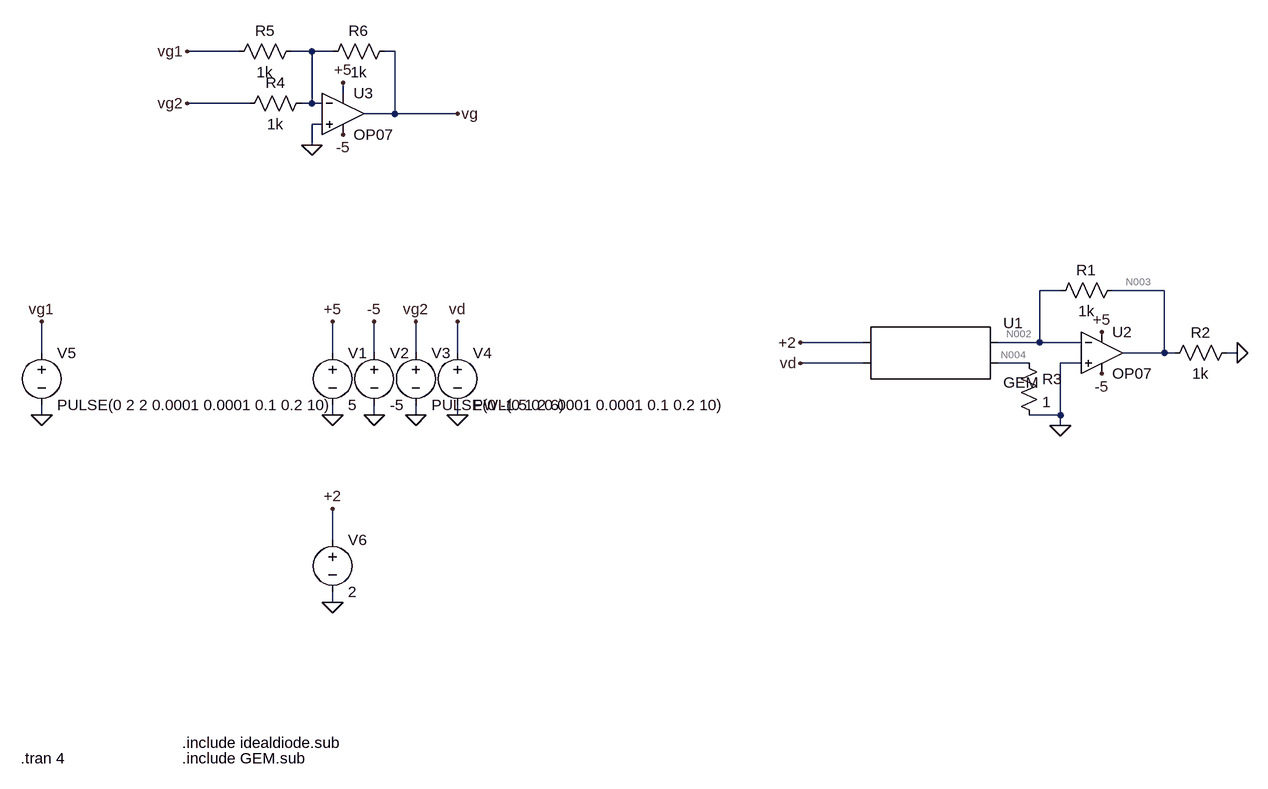
[diagram p0: schematic TestCircui4GEM.asc]
* TestCircui4GEM.asc
* U1: GEM (symbol AutoGenerated\VTEAMtri not available, pins judged from their places): pin1=+2 pin2=vd pin3=N002 pin4=N004
R1 N003 N002 1k
XU2 0 N002 +5 -5 N003 LT1001  ; OP07, pins In+ In- V+ V- OUT
V1 +5 0 5
V2 -5 0 -5
V3 vg2 0 PULSE(0 -1.5 0 0.0001 0.0001 0.1 0.2 10)
V4 vd 0 PWL(0 1 2 6)
R2 0 N003 1k
R3 N004 0 1
V5 vg1 0 PULSE(0 2 2 0.0001 0.0001 0.1 0.2 10)
XU3 0 N001 +5 -5 vg LT1001  ; OP07, pins In+ In- V+ V- OUT
R4 N001 vg2 1k
R5 N001 vg1 1k
R6 vg N001 1k
V6 +2 0 2
.include idealdiode.sub
.tran 4
.include GEM.sub
.lib LTC.lib
.backanno
.end

* Results of the author's LTspice run, read from the files saved beside the schematic
* Operating Point, zero values left out:
*   V(vd) = 1 V
*   V(n002) = 239.3 nV
*   V(+2) = 2 V
*   V(n004) = 503.4 mV
*   V(n003) = -167.4 mV
*   V(+5) = 5 V
*   V(-5) = -5 V
*   I(R3) = 503.4 mA
*   I(R2) = 167.4 µA
*   I(R1) = -167.4 µA
*   I(V4) = -167.4 µA
*   I(V2) = 4.671 mA
*   I(V1) = -4.336 mA
*   Ix(u1:DRAIN) = 167.4 µA
*   Ix(u1:SOURCE) = -167.4 µA
*   Ix(u1:XSV) = -503.4 mA
*   Ix(u2:3) = 2.086 mA
*   Ix(u2:4) = -2.421 mA
*   Ix(u2:5) = 334.8 µA
*   Ix(u3:3) = 2.25 mA
*   Ix(u3:4) = -2.25 mA
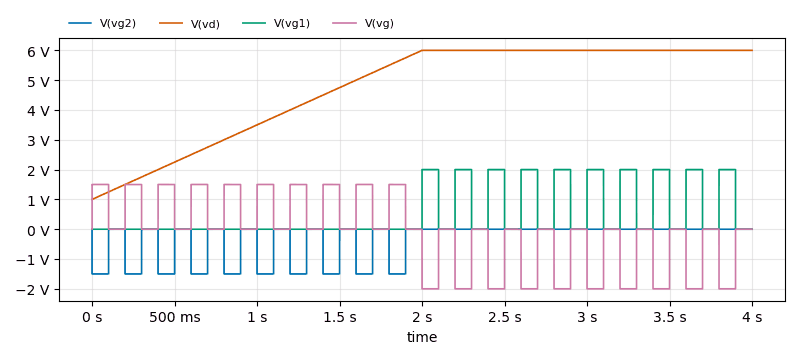
[diagram p1: Transient Analysis of TestCircui4GEM.asc, plotted from the saved traces]
* Transient Analysis, 1 run:
*   V(vg2): min -1.5 V, max 0 V, average -375.4 mV, rms 750.3 mV, last 0 V
*   V(vd): min 1 V, max 6 V, average 4.75 V, rms 5.017 V, last 6 V
*   V(vg1): min 0 V, max 2 V, average 500.5 mV, rms 1 V, last 0 V
*   V(vg): min -2 V, max 1.5 V, average -125.1 mV, rms 1.25 V, last 0 V